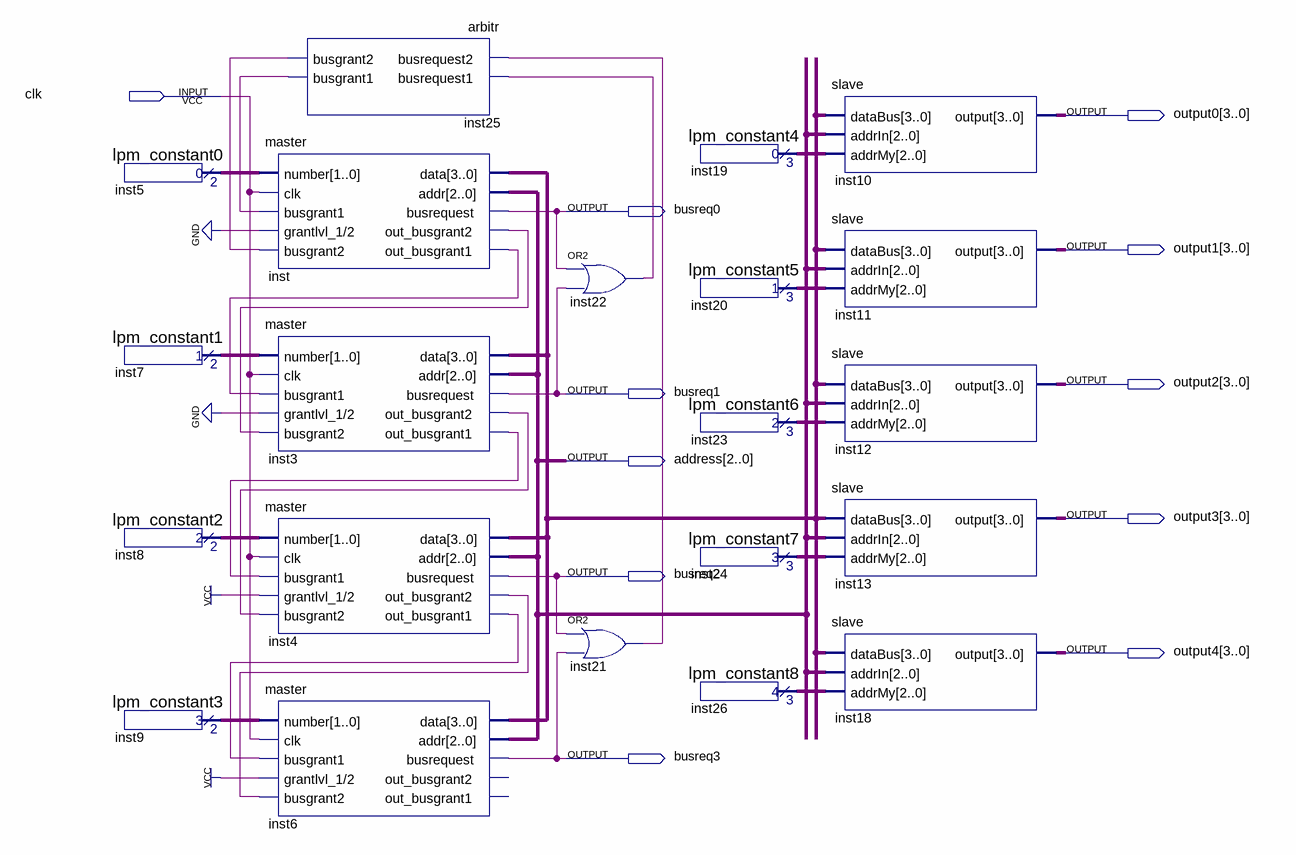
[diagram p0: schematic sheet]
// Quartus schematic arbitration.bdf as structural Verilog: 21 symbols, 11 pins
module arbitration (
  input  clk,
  output [3:0] output0,
  output busreq0,
  output [3:0] output1,
  output [3:0] output2,
  output busreq1,
  output [2:0] address,
  output [3:0] output3,
  output busreq2,
  output [3:0] output4,
  output busreq3
);

  wire inst3_out_busgrant1, inst3_out_busgrant2, inst4_out_busgrant1, inst4_out_busgrant2, inst21_out,
       inst22_out, inst25_busgrant1, inst25_busgrant2, inst_out_busgrant1, inst_out_busgrant2;
  wire [1:0] inst5_result, inst7_result, inst8_result, inst9_result;
  wire [2:0] inst19_result, inst20_result, inst23_result, inst24_result, inst26_result;
  wire [3:0] inst_data;

  lpm_constant0 inst5 (.result(inst5_result));
  lpm_constant1 inst7 (.result(inst7_result));
  lpm_constant2 inst8 (.result(inst8_result));
  lpm_constant3 inst9 (.result(inst9_result));
  arbitr inst25 (
    .busrequest2(inst21_out), .busrequest1(inst22_out), .busgrant2(inst25_busgrant2),
    .busgrant1(inst25_busgrant1));
  master inst (
    .number(inst5_result), .clk(clk), .busgrant1(inst25_busgrant1), .\grantlvl_1/2 (1'b0),
    .busgrant2(inst25_busgrant2), .data(inst_data), .addr(address), .busrequest(busreq0),
    .out_busgrant2(inst_out_busgrant2), .out_busgrant1(inst_out_busgrant1));
  master inst3 (
    .number(inst7_result), .clk(clk), .busgrant1(inst_out_busgrant1), .\grantlvl_1/2 (1'b0),
    .busgrant2(inst_out_busgrant2), .data(inst_data), .addr(address), .busrequest(busreq1),
    .out_busgrant2(inst3_out_busgrant2), .out_busgrant1(inst3_out_busgrant1));
  master inst4 (
    .number(inst8_result), .clk(clk), .busgrant1(inst3_out_busgrant1), .\grantlvl_1/2 (1'b1),
    .busgrant2(inst3_out_busgrant2), .data(inst_data), .addr(address), .busrequest(busreq2),
    .out_busgrant2(inst4_out_busgrant2), .out_busgrant1(inst4_out_busgrant1));
  master inst6 (
    .number(inst9_result), .clk(clk), .busgrant1(inst4_out_busgrant1), .\grantlvl_1/2 (1'b1),
    .busgrant2(inst4_out_busgrant2), .data(inst_data), .addr(address), .busrequest(busreq3));  // open: out_busgrant2, out_busgrant1
  or inst22 (inst22_out, busreq0, busreq1);
  or inst21 (inst21_out, busreq2, busreq3);
  lpm_constant4 inst19 (.result(inst19_result));
  lpm_constant5 inst20 (.result(inst20_result));
  lpm_constant6 inst23 (.result(inst23_result));
  lpm_constant7 inst24 (.result(inst24_result));
  lpm_constant8 inst26 (.result(inst26_result));
  slave inst10 (.dataBus(inst_data), .addrIn(address), .addrMy(inst19_result), .\output (output0));
  slave inst11 (.dataBus(inst_data), .addrIn(address), .addrMy(inst20_result), .\output (output1));
  slave inst12 (.dataBus(inst_data), .addrIn(address), .addrMy(inst23_result), .\output (output2));
  slave inst13 (.dataBus(inst_data), .addrIn(address), .addrMy(inst24_result), .\output (output3));
  slave inst18 (.dataBus(inst_data), .addrIn(address), .addrMy(inst26_result), .\output (output4));
endmodule
